# Altium project Group_1.PrjPcb
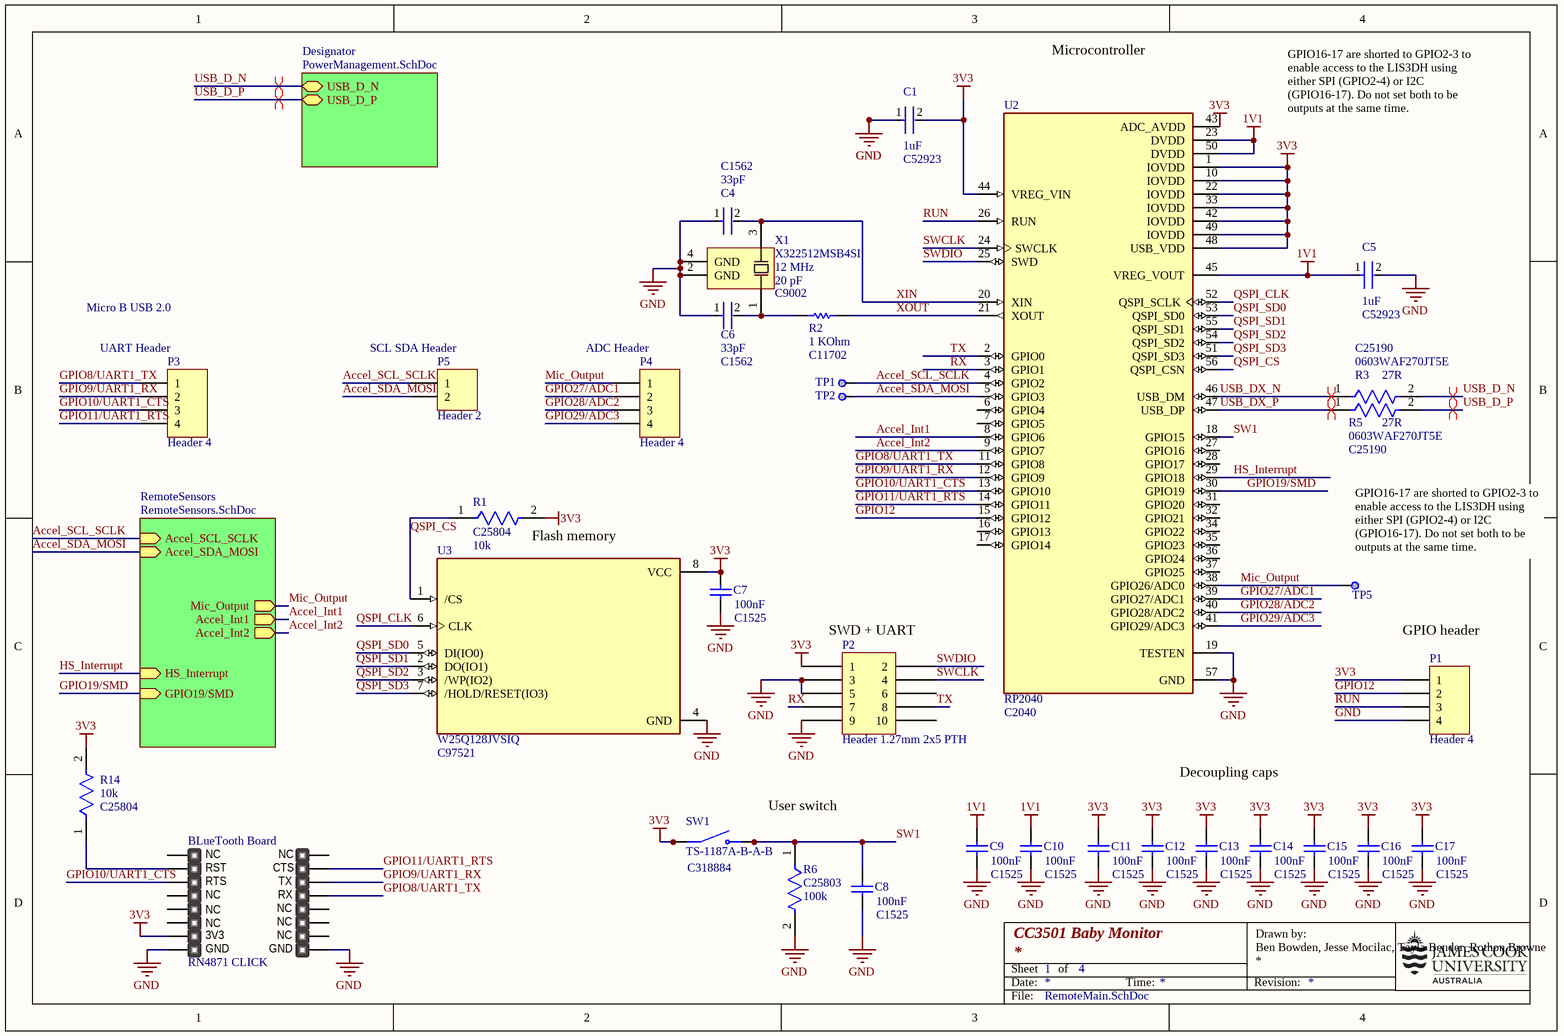
[diagram p0: RemoteMain.SchDoc]
3 sheets, 74 parts. Net scope: hierarchical (ports join the sheet entries above them; power ports are global).
Board files: RemoteUnitBoard.PcbDoc, SENSORM-TH_3P_AS312.pcbdoc
Sheets:
  RemoteMain.SchDoc
    RemoteSensors = RemoteSensors.SchDoc
    Designator = PowerManagement.SchDoc

## Sheet RemoteMain.SchDoc
size A4; Author: Ben Bowden, Jesse Mocilac, Tayla Bender, Rothon Browne; CompanyName: James Cook University; DrawnBy1: Ben Bowden, Jesse Mocilac, Tayla Bender, Rothon Browne; Organization: James Cook University; Title1: CC3501 Baby Monitor; SheetNumber: 1; SheetTotal: 4; ProjectName: *ProjectName

### Parts
BLueTooth_Board  RN4871 CLICK  [mikroBUS - Large]  (no BOM)
C1  JLCPCB Part: C52923  Capacitance: 1uF  [FP-CL542-IPC_C]  (hidden comment: CL05A105KA5NQNC)
C4  JLCPCB Part: C1562  Capacitance: 33pF  [FP-0402-L_1_0_1-W_0_5_0_1-IPC_A]  (hidden comment: 0402CG330J500NT)
C5  JLCPCB Part: C52923  Capacitance: 1uF  [FP-CL542-IPC_C]  (hidden comment: CL05A105KA5NQNC)
C6  JLCPCB Part: C1562  Capacitance: 33pF  [FP-0402-L_1_0_1-W_0_5_0_1-IPC_A]  (hidden comment: 0402CG330J500NT)
C7  JLCPCB Part: C1525  Capacitance: 100nF  [CAPC1050X55X23ML05T13]  (hidden comment: CL05B104KO5NNNC)
C8  JLCPCB Part: C1525  Capacitance: 100nF  [CAPC1050X55X23ML05T13]  (hidden comment: CL05B104KO5NNNC)
C9  JLCPCB Part: C1525  Capacitance: 100nF  [CAPC1050X55X23ML05T13]  (hidden comment: CL05B104KO5NNNC)
C10  JLCPCB Part: C1525  Capacitance: 100nF  [CAPC1050X55X23ML05T13]  (hidden comment: CL05B104KO5NNNC)
C11  JLCPCB Part: C1525  Capacitance: 100nF  [CAPC1050X55X23ML05T13]  (hidden comment: CL05B104KO5NNNC)
C12  JLCPCB Part: C1525  Capacitance: 100nF  [CAPC1050X55X23ML05T13]  (hidden comment: CL05B104KO5NNNC)
C13  JLCPCB Part: C1525  Capacitance: 100nF  [CAPC1050X55X23ML05T13]  (hidden comment: CL05B104KO5NNNC)
C14  JLCPCB Part: C1525  Capacitance: 100nF  [CAPC1050X55X23ML05T13]  (hidden comment: CL05B104KO5NNNC)
C15  JLCPCB Part: C1525  Capacitance: 100nF  [CAPC1050X55X23ML05T13]  (hidden comment: CL05B104KO5NNNC)
C16  JLCPCB Part: C1525  Capacitance: 100nF  [CAPC1050X55X23ML05T13]  (hidden comment: CL05B104KO5NNNC)
C17  JLCPCB Part: C1525  Capacitance: 100nF  [CAPC1050X55X23ML05T13]  (hidden comment: CL05B104KO5NNNC)
P1  Header 4  [HDR1X4]
P2  Header 1.27mm 2x5 PTH  [Header 1.27mm 2x5 PTH]
P3  Header 4  [HDR1X4]
P4  Header 4  [HDR1X4]
P5  Header 2  [HDR1X2]
R1  JLCPCB Part: C25804  Resistance: 10k  [FP-CRCW0603-e3-IPC_B]  (hidden comment: 0603WAF1002T5E)
R2  Resistance: 1 KOhm  JLCPCB Part: C11702  [RESC1005X40X25NL05T05]  (hidden comment: 0402WGF1001TCE)
R3  0603WAF270JT5E  JLCPCB Part: C25190  Resistance: 27R  [FP-CRCW0603-e3-IPC_B]
R5  0603WAF270JT5E  JLCPCB Part: C25190  Resistance: 27R  [FP-CRCW0603-e3-IPC_B]
R6  JLCPCB Part: C25803  Resistance: 100k  [FP-CRCW0603-e3-IPC_B]  (hidden comment: 0603WAF1003T5E)
R14  JLCPCB Part: C25804  Resistance: 10k  [FP-CRCW0603-e3-IPC_B]  (hidden comment: 0603WAF1002T5E)
SW1  TS-1187A-B-A-B  JLCPCB Part: C318884  [SW_TS-1187A-B-A-B]
TP1  Test point  [Test point-Footprint-1]  (value not drawn)  (no BOM)
TP2  Test point  [Test point-Footprint-1]  (value not drawn)  (no BOM)
TP5  Test point  [Test point-Footprint-1]  (value not drawn)  (no BOM)
U2  RP2040  JLCPCB Part: C2040  [QFN40P700X700X90-57N]
U3  W25Q128JVSIQ  JLCPCB Part: C97521  [SOIC127P790X216-8N]
X1  X322512MSB4SI  Frequency: 12 MHz  Load capacitance: 20 pF  JLCPCB Part: C9002  [X322512MSB4SI-Footprint-1]

### Sub-sheets
Designator = PowerManagement.SchDoc: USB_D_N (bidir), USB_D_P (bidir)
RemoteSensors = RemoteSensors.SchDoc: Accel_SCL_SCLK (in), Accel_SDA_MOSI (in), Accel_Int2 (out), Accel_Int1 (out), Mic_Output (out), HS_Interrupt (in), GPIO19/SMD (in)

### Nets
1V1: C5.1 C9.2 C10.2 U2.23(DVDD) U2.45(VREG_VOUT) U2.50(DVDD)
3V3: BLueTooth_Board.7(3.3V) C1.2 C7.2 C11.2 C12.2 C13.2 C14.2 C15.2 C16.2 C17.2 P1.1 P2.1 R1.2 R14.2 SW1.A(COM) SW1.B(COM) U2.1(IOVDD) U2.10(IOVDD) U2.22(IOVDD) U2.33(IOVDD) U2.42(IOVDD) U2.43(ADC_AVDD) U2.44(VREG_VIN) U2.48(USB_VDD) U2.49(IOVDD) U3.8(VCC)
GND: BLueTooth_Board.8(GND) BLueTooth_Board.9(GND) C1.1 C4.1 C5.2 C6.1 C7.1 C8.1 C9.1 C10.1 C11.1 C12.1 C13.1 C14.1 C15.1 C16.1 C17.1 P1.4 P2.3 P2.5 P2.9 R6.2 U2.19(TESTEN) U2.57(GND) U3.4(GND) X1.2(GND) X1.4(GND)
Accel_Int1: U2.8(GPIO6) ; sheet RemoteSensors/Accel_Int1
Accel_Int2: U2.9(GPIO7) ; sheet RemoteSensors/Accel_Int2
Accel_SCL_SCLK: P5.1 TP1.1 U2.4(GPIO2) ; sheet RemoteSensors/Accel_SCL_SCLK
Accel_SDA_MOSI: P5.2 TP2.1 U2.5(GPIO3) ; sheet RemoteSensors/Accel_SDA_MOSI
GPIO8/UART1_TX: BLueTooth_Board.13(TX) P3.1 U2.11(GPIO8)
GPIO9/UART1_RX: BLueTooth_Board.14(RX) P3.2 U2.12(GPIO9)
GPIO10/UART1_CTS: BLueTooth_Board.3(CS) P3.3 U2.13(GPIO10)
GPIO11/UART1_RTS: BLueTooth_Board.15(INT) P3.4 U2.14(GPIO11)
GPIO12: P1.2 U2.15(GPIO12)
GPIO19/SMD: U2.30(GPIO19) ; sheet RemoteSensors/GPIO19/SMD
GPIO27/ADC1: P4.2 U2.39(GPIO27/ADC1)
GPIO28/ADC2: P4.3 U2.40(GPIO28/ADC2)
GPIO29/ADC3: P4.4 U2.41(GPIO29/ADC3)
HS_Interrupt: U2.29(GPIO18) ; sheet RemoteSensors/HS_Interrupt
Mic_Output: P4.1 TP5.1 U2.38(GPIO26/ADC0) ; sheet RemoteSensors/Mic_Output
QSPI_CLK: U2.52(QSPI_SCLK) U3.6(CLK)
QSPI_CS: R1.1 U2.56(QSPI_CSN) U3.1(/CS)
QSPI_SD0: U2.53(QSPI_SD0) U3.5(DI(IO0))
QSPI_SD1: U2.55(QSPI_SD1) U3.2(DO(IO1))
QSPI_SD2: U2.54(QSPI_SD2) U3.3(/WP(IO2))
QSPI_SD3: U2.51(QSPI_SD3) U3.7(/HOLD/RESET(IO3))
RUN: P1.3 U2.26(RUN)
RX: P2.7 U2.3(GPIO1)
SW1: C8.2 R6.1 SW1.C(NO) SW1.D(NO) U2.18(GPIO15)
SWCLK: P2.4 U2.24(SWCLK)
SWDIO: P2.2 U2.25(SWD)
TX: P2.8 U2.2(GPIO0)
USB_D_N: R3.2 ; sheet Designator/USB_D_N
USB_D_P: R5.2 ; sheet Designator/USB_D_P
USB_DX_N: R3.1 U2.46(USB_DM)
USB_DX_P: R5.1 U2.47(USB_DP)
XIN: C4.2 U2.20(XIN) X1.3(OSC2)
XOUT: R2.2 U2.21(XOUT)
NetBLueTooth_Board_2: BLueTooth_Board.2(RST) R14.1
NetC6_2: C6.2 R2.1 X1.1(OSC1)

Not connected (* = marked no-connect by the designer): BLueTooth_Board 1(AN) 4(SCK) 5(MISO) 6(MOSI) 10(5V) 11(SDA) 12(SCL) 16(PWM); P2 6 10; U2 6(GPIO4) 7(GPIO5) 16(GPIO13) 17(GPIO14) 27(GPIO16) 28(GPIO17) 31(GPIO20) 32(GPIO21) 34(GPIO22) 35(GPIO23) 36(GPIO24) 37(GPIO25)

### Layout directives
differential pair: USB_D_N, USB_D_P, USB_DX_N, USB_DX_P

### Notes on the sheet
- Microcontroller
- GPIO16-17 are shorted to GPIO2-3 to enable access to the LIS3DH using either SPI (GPIO2-4) or I2C (GPIO16-17). Do not set both to be outputs at the same time.
- Micro B USB 2.0
- (near P3) UART Header
- (near P5) SCL SDA Header
- (near P4) ADC Header
- Flash memory
- (near TP5) GPIO16-17 are shorted to GPIO2-3 to enable access to the LIS3DH using either SPI (GPIO2-4) or I2C (GPIO16-17). Do not set both to be outputs at the same time.
- (near P2) SWD + UART
- GPIO header
- Decoupling caps
- User switch
- Date:
- Sheet
- of
- Time:
- Revision:
- Drawn by:
- File:
- (in symbol CMP-011-00000-2) NC; CTS; RTS; 3V3

### Library data of the parts
BLueTooth_Board = CMP-011-00000-2: mikroBUS compatible add-on board; Design Item ID: mikroBUS compatible add-on board; Source: mikroBUS_Add-on_standard.SchLib
C1 C5 = CMP-00005-3: Cap Ceramic 1uF 25V X5R ±10% SMD 0402 +85°C Paper T/R; Case Code (Imperial): 0402; Thickness: 0.022inch; Material: Ceramic; Length: 1mm; Voltage Rating: 25V; Lead Free: Lead Free; Package Quantity: 10000; Min Operating Temperature: -55°C; Radiation Hardening: No; Case/Package: 0402; Case Code (Metric): 1005; Height: 0.5mm; Width: 0.02inch; Mount: Surface Mount; Dielectric: X5R; Tolerance: 10%; Depth: 0.5mm; Max Operating Temperature: 85°C; Packaging: Tape and Reel
C4 C6 = CMP-00008-5: General Purpose Ceramic Capacitor, 0402, 33pF, 5%, C0G, 30ppm/°C, 50V; Insulation Resistance: 100GR; RoHS Compliant: Yes; REACH SVHC: No SVHC; Package Quantity: 1; Voltage Rating (DC): 50V; Voltage: 50V; Length: 1mm; Number of Pins: 2; Case Code (Imperial): 0402; Mount: Surface Mount; Min Operating Temperature: -55°C; Radiation Hardening: No; Max Operating Temperature: 125°C; Contact Plating: Tin; Case/Package: 0402; Thickness: 0.022inch; Height: 0.5mm; Construction: Flat; Tolerance: 5%; Depth: 0.5mm; Case Code (Metric): 1005; Series: -; Temperature Coefficient: 30ppm/°C; Lead Free: Lead Free; Voltage Rating: 50V; Packaging: Tape and Reel; Width: 0.5mm; Dielectric: C0G; Termination: SMD/SMT
C7-C17 = CMP-00007-3: Chip Capacitor, 100 nF, +/- 10%, 16 V, -55 to 125 degC, 0402 (1005 Metric), RoHS, Tape and Reel; Manufacturer: Samsung Electro-Mechanics; Dielectric: X7R; Rated Voltage: 16V; Manufacturer URL: http://www.samsungsem.com/global/index.jsp; Case Size/Dimension: 0402; Tolerance (%): ±10%; Datasheet Version: Nov-10; Datasheet URL: https://datasheet.ciiva.com/29198/458718-da-01-en-vs-kondensator-0402-29198423.pdf
P1 P3 P4 = CMP-002-00124-1: Header, 4-Pin; Signal Integrity: Connector; LatestRevisionNote: Re-released for DXP Platform.; Component Type: Standard; Design Item ID: Header 4; Source: Miscellaneous Connectors.SchLib; Pin Count: 4; Publisher: Altium Limited; LatestRevisionDate: 17-Jul-2002
P2 = CMP-005-0002-2: Header 1.27mm pitch, 2x5, PTH through hole; Pins: 10; element14 Item: 1577743; Design Item ID: Header 1.27mm 2x5 PTH; Source: JCULibrary.SchLib; Component Type: Standard
P5 = CMP-002-00097-1: Header, 2-Pin; Signal Integrity: Connector; LatestRevisionDate: 17-Jul-2002; Publisher: Altium Limited; Pin Count: 2; Design Item ID: Header 2; LatestRevisionNote: Re-released for DXP Platform.; Source: Miscellaneous Connectors.SchLib; Component Type: Standard
R1 R14 = CMP-009-0009-1: RES Thick Film, 10kΩ, 1%, 0.1W, 100ppm/°C, 0603; Voltage Rating: 75V; Power Rating: 100mW; Composition: Thick Film; Military Standard: Not; Temperature Coefficient: 100ppm/°C; Length: 1.55mm; Tolerance: 1%; Lead Free: Lead Free; Max Operating Temperature: 155°C; Number of Pins: 2; Width: 0.85mm; Termination: SMD/SMT; Packaging: Tape and Reel; Weight: 7.1E-05oz; Radiation Hardening: No; Voltage Rating (DC): 75V; Height: 0.45mm; Min Operating Temperature: -55°C; Mount: Surface Mount; Contact Plating: Tin; Case Code (Metric): 1608; Case Code (Imperial): 0603; Depth: 0.85mm; Case/Package: 0603; Package Quantity: 5000
R2 = CMP-009-0000-2: Chip Resistor, 1 KOhm, +/- 1%, 100 mW, -55 to 155 degC, 0402 (1005 Metric), RoHS, Tape and Reel; Manufacturer: Basic Passives; Power Rating: 100 mW; Case\/Package: 0402; Voltage Rating: 50 V; RoHSCompliant: true; Mount: Surface Mount; Length: 1 mm; Height: 0.35 mm; Pins: 2; Case Code (Imperial): 0402; PackageDescription: 2-Pin Surface Mount Device, Body 1 x 0.5 mm; Radiation Hardening: No; Width: 0.5 mm; Mounting Technology: Surface Mount; PackageReference: 0402; Case Code (Metric): 1005; Packaging: Tape and Reel; Max Operating Temperature: 155 degC; PartNumber: 0402WGF1001TCE; Package Quantity: 10000; Min Operating Temperature: -55 degC; Tolerance: 1%; REACH SVHC: Yes
R3 R5 = CMP-00004-5: RES Thick Film, 27Ω, 1%, 0.1W, 200ppm/°C, 0603; Power Rating: 100mW; Temperature Coefficient: 100ppm/°C; Voltage Rating: 75V; Length: 1.55mm; Radiation Hardening: No; Width: 0.85mm; Case Code (Metric): 1608; Composition: Thick Film; Max Operating Temperature: 155°C; Number of Pins: 2; Contact Plating: Tin; Weight: 7.1E-05oz; Case Code (Imperial): 0603; Min Operating Temperature: -55°C; Mount: Surface Mount; Height: 0.45mm; Package Quantity: 5000; Military Standard: Not; Voltage Rating (DC): 75V; Packaging: Tape and Reel; Lead Free: Lead Free; Depth: 0.85mm; Termination: SMD/SMT; Case/Package: 0603; Tolerance: 1%
R6 = CMP-009-0004-3: RES Thick Film, 100kΩ, 1%, 0.1W, 100ppm/°C, 0603; Power Rating: 100mW; Voltage Rating: 75V; Mount: Surface Mount; Number of Pins: 2; Depth: 0.85mm; Case/Package: 0603; Composition: Thick Film; Max Operating Temperature: 155°C; Case Code (Metric): 1608; Contact Plating: Tin; Temperature Coefficient: 100ppm/°C; Weight: 7.1E-05oz; Height: 0.45mm; Termination: SMD/SMT; Tolerance: 1%; Min Operating Temperature: -55°C; Lead Free: Lead Free; Voltage Rating (DC): 75V; Case Code (Imperial): 0603; Length: 1.55mm; Packaging: Tape and Reel; Package Quantity: 5000; Radiation Hardening: No; Width: 0.85mm; Military Standard: Not
SW1 = CMP-051-000000-5: SPST 50mA @ 12VDC Top Actuated Round Button 160gf SMD Tactile Switches RoHS; Source: TS-1187A-B-A-B.SchLib; Package: None; Availability: Unavailable; MP: TS-1187A-B-A-B; Value: *; Price: None; Pin Count: 4; Component Type: Standard; Design Item ID: TS-1187A-B-A-B
TP1 TP2 TP5 = CMP-004-0001-1: Test point for in-circuit debugging (0.3mm hole, 0.7mm diameter)
U2 = CMP-043-000000-5: ARM Cortex-M0+ MCU 32-Bit Microcontroller for Raspberry Pi Pico; Design Item ID: RP2040; Price: None; Component Type: Standard; Package: None; Availability: Available; Value: *; Pin Count: 57; Source: RP2040.SchLib; MP: RP2040
U3 = CMP-031-00006-4: FLASH - NOR Memory IC 128Mb (16M x 8) SPI - Quad I/O, QPI, DTR 133 MHz 8-SOIC; MF: Winbond Electronics; MP: W25Q128JVSIQ; Design Item ID: W25Q128JVSIQ; Check_prices: https://www.snapeda.com/parts/W25Q128JVSIQ/Winbond+Electronics/view-part/?ref=eda; Price: None; Purchase-URL: https://pricing.snapeda.com/search/part/W25Q128JVSIQ/?ref=eda; Pin Count: 8; Package: SOIC-8 Winbond; Availability: In Stock; Source: W25Q128JVSIQ.SchLib; Value: *; SnapEDA_Link: https://www.snapeda.com/parts/W25Q128JVSIQ/Winbond+Electronics/view-part/?ref=snap; Component Type: Standard
X1 = CMP-00002-4: 12MHz SMD Crystal Resonator 20pF ±10ppm ±30ppm -40℃~+85℃ SMD3225-4P  Crystals ROHS Yangxing Tech; Max ESR: 80 Ω

## Sheet RemoteSensors.SchDoc
size A4; Author: Ben Bowden, Jesse Mocilac, Tayla Bender, Rothon Browne; CompanyName: James Cook University; DrawnBy1: Ben Bowden, Jesse Mocilac, Tayla Bender, Rothon Browne; Organization: James Cook University; Title1: CC3501 Baby Monitor; SheetNumber: 3; SheetTotal: 4; ProjectName: *ProjectName
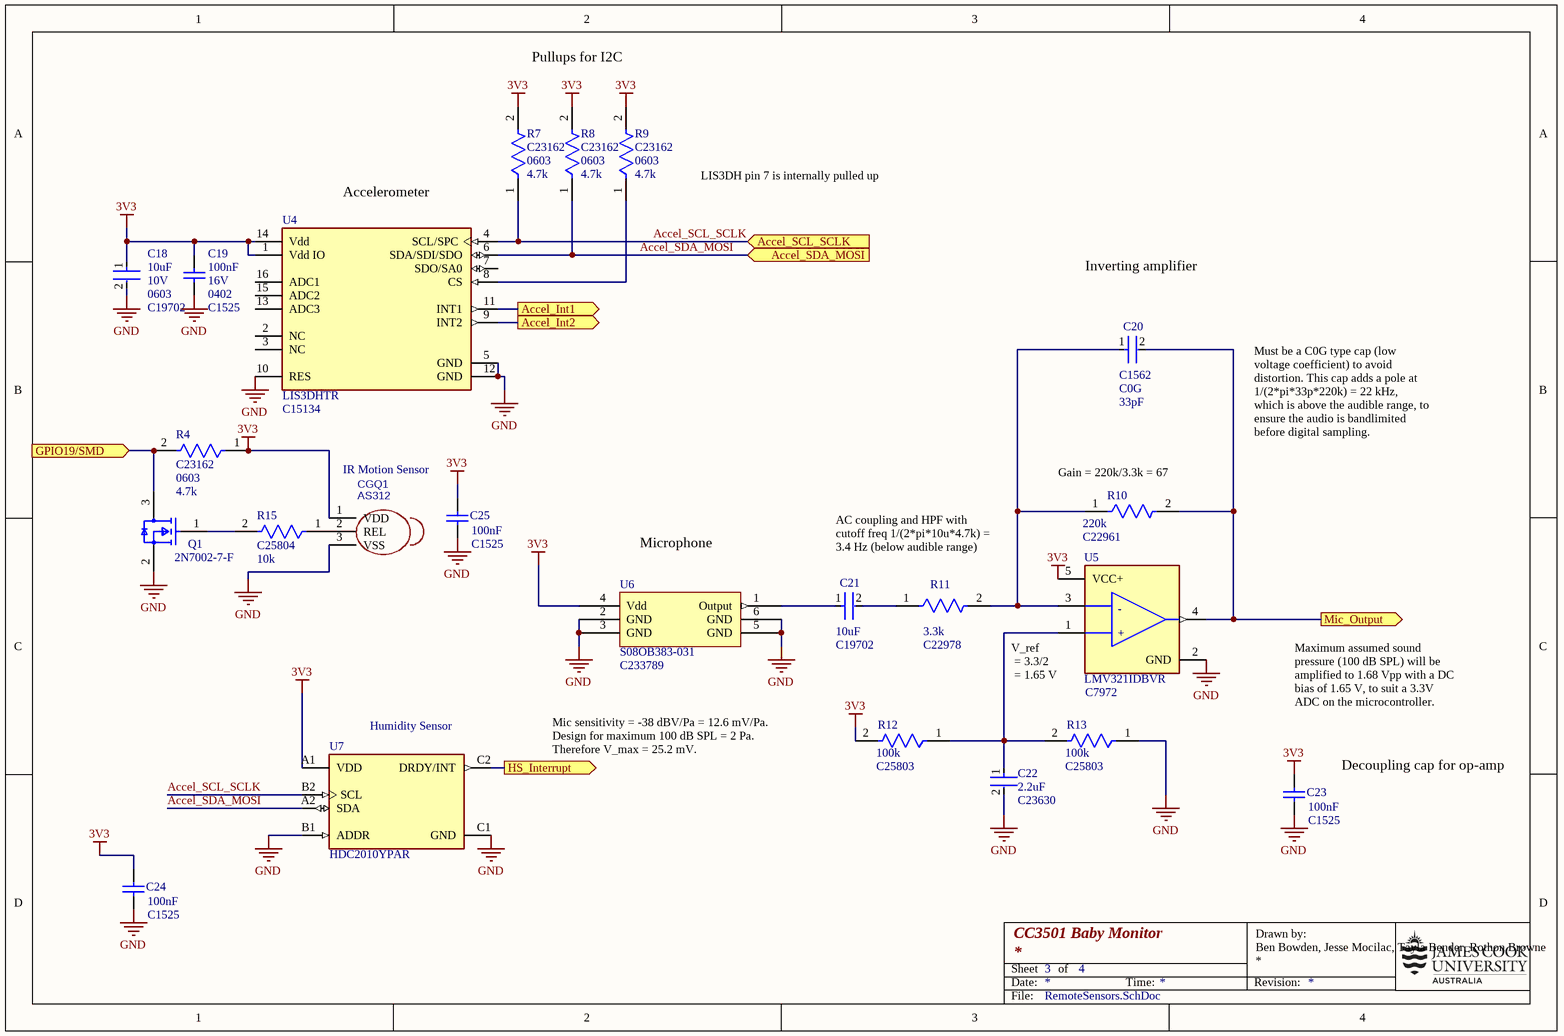
[diagram p1: RemoteSensors.SchDoc]

### Parts
C18  Voltage Rating: 10V  Case Code (Imperial): 0603  JLCPCB Part: C19702  Capacitance: 10uF  [FP-CL10-IPC_B]  (hidden comment: CL10A106KP8NNNC)
C19  JLCPCB Part: C1525  Case Size/Dimension: 0402  Capacitance: 100nF  Rated Voltage: 16V  [CAPC1050X55X23ML05T13]  (hidden comment: CL05B104KO5NNNC)
C20  Capacitance: 33pF  Dielectric: C0G  JLCPCB Part: C1562  [FP-0402-L_1_0_1-W_0_5_0_1-IPC_A]  (hidden comment: 0402CG330J500NT)
C21  JLCPCB Part: C19702  Capacitance: 10uF  [FP-CL10-IPC_B]  (hidden comment: CL10A106KP8NNNC)
C22  Capacitance: 2.2uF  JLCPCB Part: C23630  [FP-CL10-IPC_B]  (hidden comment: CL10A225KO8NNNC)
C23  JLCPCB Part: C1525  Capacitance: 100nF  [CAPC1050X55X23ML05T13]  (hidden comment: CL05B104KO5NNNC)
C24  JLCPCB Part: C1525  Capacitance: 100nF  [CAPC1050X55X23ML05T13]  (hidden comment: CL05B104KO5NNNC)
C25  JLCPCB Part: C1525  Capacitance: 100nF  [CAPC1050X55X23ML05T13]  (hidden comment: CL05B104KO5NNNC)
CGQ1  AS312  [SENSORM-TH_3P_AS312]
Q1  2N7002-7-F  [FP-SOT23-MFG]
R4  JLCPCB Part: C23162  Case/Package: 0603  Resistance: 4.7k  [FP-CRCW0603-e3-IPC_B]  (hidden comment: 0603WAF4701T5E)
R7  JLCPCB Part: C23162  Case/Package: 0603  Resistance: 4.7k  [FP-CRCW0603-e3-IPC_B]  (hidden comment: 0603WAF4701T5E)
R8  JLCPCB Part: C23162  Case/Package: 0603  Resistance: 4.7k  [FP-CRCW0603-e3-IPC_B]  (hidden comment: 0603WAF4701T5E)
R9  JLCPCB Part: C23162  Case/Package: 0603  Resistance: 4.7k  [FP-CRCW0603-e3-IPC_B]  (hidden comment: 0603WAF4701T5E)
R10  Resistance: 220k  JLCPCB Part: C22961  [FP-CRCW0603-e3-IPC_B]  (hidden comment: 0603WAF2203T5E)
R11  JLCPCB Part: C22978  Resistance: 3.3k  [FP-CRCW0603-e3-IPC_B]  (hidden comment: 0603WAF3301T5E)
R12  JLCPCB Part: C25803  Resistance: 100k  [FP-CRCW0603-e3-IPC_B]  (hidden comment: 0603WAF1003T5E)
R13  JLCPCB Part: C25803  Resistance: 100k  [FP-CRCW0603-e3-IPC_B]  (hidden comment: 0603WAF1003T5E)
R15  JLCPCB Part: C25804  Resistance: 10k  [FP-CRCW0603-e3-IPC_B]  (hidden comment: 0603WAF1002T5E)
U4  LIS3DHTR  JLCPCB Part: C15134  [FP-LGA-16-7983231-MFG]
U5  LMV321IDBVR  JLCPCB Part: C7972  [FP-DBV0005A-IPC_B]
U6  S08OB383-031  JLCPCB Part: C233789  [Goertek_S08OB381-026]
U7  HDC2010YPAR  [FP-YPA0006-MFG]

### Ports
Accel_Int1 (out), Accel_Int2 (out), Accel_SCL_SCLK (in), Accel_SDA_MOSI (in), GPIO19/SMD (in), HS_Interrupt (out), Mic_Output (out)

### Nets
3V3: C18.1 C19.2 C23.2 C24.2 C25.2 CGQ1.1(VDD) R4.1 R7.2 R8.2 R9.2 R12.2 U4.1(Vdd_IO) U4.14(Vdd) U5.5(VCC+) U6.4(Vdd) U7.A1(VDD)
GND: C18.2 C19.1 C22.2 C23.1 C24.1 C25.1 CGQ1.3(VSS) Q1.2(S) R13.1 U4.5(GND) U4.10(RES) U4.12(GND) U5.2(GND) U6.2(GND) U6.3(GND) U6.5(GND) U6.6(GND) U7.B1(ADDR) U7.C1(GND)
Accel_Int1: U4.11(INT1) ; port Accel_Int1
Accel_Int2: U4.9(INT2) ; port Accel_Int2
Accel_SCL_SCLK: R7.1 U4.4(SCL/SPC) U7.B2(SCL) ; port Accel_SCL_SCLK
Accel_SDA_MOSI: R8.1 U4.6(SDA/SDI/SDO) U7.A2(SDA) ; port Accel_SDA_MOSI
GPIO19/SMD: Q1.3(D) R4.2 ; port GPIO19/SMD
HS_Interrupt: U7.C2(DRDY/INT) ; port HS_Interrupt
Mic_Output: C20.2 R10.2 U5.4(OUT) ; port Mic_Output
NetC20_1: C20.1 R10.1 R11.2 U5.3(1IN-)
NetC21_1: C21.1 U6.1(Output)
NetC21_2: C21.2 R11.1
NetC22_1: C22.1 R12.1 R13.2 U5.1(1IN+)
NetCGQ1_2: CGQ1.2(REL) R15.1
NetQ1_1: Q1.1(G) R15.2
NetR9_1: R9.1 U4.8(CS)

Not connected (* = marked no-connect by the designer): U4 2(NC) 3(NC) 7(SDO/SA0) 13(ADC3) 15(ADC2) 16(ADC1)

### Notes on the sheet
- Pullups for I2C
- (near U4) Accelerometer
- LIS3DH pin 7 is internally pulled up
- Inverting amplifier
- IR Motion Sensor
- (near R10) Gain = 220k/3.3k = 67
- Must be a C0G type cap (low voltage coefficient) to avoid distortion. This cap adds a pole at 1/(2*pi*33p*220k) = 22 kHz, which is above the audible range, to ensure the audio is bandlimited before digital sampling.
- Microphone
- AC coupling and HPF with cutoff freq 1/(2*pi*10u*4.7k) = 3.4 Hz (below audible range)
- (near U5) V_ref
  = 3.3/2
  = 1.65 V
- Maximum assumed sound pressure (100 dB SPL) will be amplified to 1.68 Vpp with a DC bias of 1.65 V, to suit a 3.3V ADC on the microcontroller.
- (near U7) Humidity Sensor
- Mic sensitivity = -38 dBV/Pa = 12.6 mV/Pa.
  Design for maximum 100 dB SPL = 2 Pa.
  Therefore V_max = 25.2 mV.
- (near C23) Decoupling cap for op-amp
- Date:
- Sheet
- of
- Time:
- Revision:
- Drawn by:
- File:
- (in symbol CMP-00012-2) +

### Library data of the parts
C18 C21 = CMP-00006-4: Cap Ceramic 10uF 10V X5R ±10% Pad SMD 0603 +85°C T/R; Max Operating Temperature: 85°C; Tolerance: 10%; Case/Package: 0603; Mount: Surface Mount; Packaging: Tape and Reel; Width: 0.031inch; Thickness: 0.041inch; Length: 0.063inch; Case Code (Metric): 1608; Min Operating Temperature: -55°C
  C21: Voltage Rating: 10V; Case Code (Imperial): 0603
C19 = CMP-00007-3: Chip Capacitor, 100 nF, +/- 10%, 16 V, -55 to 125 degC, 0402 (1005 Metric), RoHS, Tape and Reel; Manufacturer: Samsung Electro-Mechanics; Dielectric: X7R; Manufacturer URL: http://www.samsungsem.com/global/index.jsp; Tolerance (%): ±10%; Datasheet Version: Nov-10; Datasheet URL: https://datasheet.ciiva.com/29198/458718-da-01-en-vs-kondensator-0402-29198423.pdf
C20 = CMP-00008-5: as C4 on sheet RemoteMain; RoHS Compliant: Yes; Case Code (Metric): 1005; Voltage Rating (DC): 50V; REACH SVHC: No SVHC; Packaging: Tape and Reel; Length: 1mm; Radiation Hardening: No; Mount: Surface Mount; Depth: 0.5mm; Width: 0.5mm; Series: -; Thickness: 0.022inch; Contact Plating: Tin; Voltage Rating: 50V; Case/Package: 0402; Construction: Flat; Max Operating Temperature: 125°C; Lead Free: Lead Free; Voltage: 50V; Termination: SMD/SMT; Height: 0.5mm; Case Code (Imperial): 0402; Temperature Coefficient: 30ppm/°C; Number of Pins: 2; Min Operating Temperature: -55°C; Package Quantity: 1; Tolerance: 5%
C22 = CMP-006-0001-1: Cap Ceramic 2.2uF 16V X5R ±20% Pad SMD 0603 +85°C T/R; Tolerance: 10%; Case Code (Metric): 1608; Thickness: 0.035inch; Case Code (Imperial): 0603; Width: 0.031inch; Voltage Rating: 16V; Min Operating Temperature: -55°C; Case/Package: 0603; Max Operating Temperature: 85°C; Length: 1.6mm; Packaging: Tape and Reel; Mount: Surface Mount
C23-C25 = CMP-00007-3: as C7 on sheet RemoteMain; Manufacturer URL: http://www.samsungsem.com/global/index.jsp; Case Size/Dimension: 0402; Tolerance (%): ±10%; Datasheet Version: Nov-10; Datasheet URL: https://datasheet.ciiva.com/29198/458718-da-01-en-vs-kondensator-0402-29198423.pdf
CGQ1 = AS312: Manufacturer: 森霸; Supplier: LCSC; Manufacturer Part: AS312; Supplier Part: C90465; JLCPCB Part Class: Extended Part; spicePre: C; spiceSymbolName: AS312
Q1 = CMP-2000-04929-2: MOSFET N-CH 60V 115MA SOT23-3; Turn-On Delay Time: 7ns; Turn-Off Delay Time: 11ns; Drain to Source Resistance: 7.5R; Rise Time: 3ns; Drain to Source Breakdown Voltage: 70V; Input Capacitance: 50pF; Number of Elements: 1; Power Dissipation: 540mW; Max Power Dissipation: 300mW; Fall Time: 5.6ns; Gate to Source Voltage (Vgs): 20V; Threshold Voltage: 2.5V; Element Configuration: Single; Termination: SMD/SMT; Weight: 0.000282oz; Radiation Hardening: No; Max Operating Temperature: 150°C; On-State Resistance: 7.5R; Mount: Surface Mount; Current Rating: 115mA; Contact Plating: Tin; Lead Free: Lead Free; Min Operating Temperature: -55°C; Number of Pins: 3; REACH SVHC: No SVHC; Drain to Source Voltage (Vdss): 60V; Width: 1.3mm; Package Quantity: 3000; Length: 2.9mm; Case/Package: SOT-23; Number of Channels: 1; Dual Supply Voltage: 60V; Packaging: Tape and Reel; Height: 1mm; Voltage Rating (DC): 60V; Nominal Vgs: 2.5V; Continuous Drain Current (ID): 115mA; Voltage: 60V; Rds On Max: 7.5R
R4 R7-R9 = CMP-009-0001-3: RES Thick Film, 4.7kΩ, 1%, 0.1W, 100ppm/°C, 0603; Voltage Rating (DC): 75V; Power Rating: 100mW; Mount: Surface Mount; Width: 0.85mm; Weight: 7.1E-05oz; Case Code (Imperial): 0603; Radiation Hardening: No; Min Operating Temperature: -55°C; Composition: Thick Film; Temperature Coefficient: 100ppm/°C; Voltage Rating: 75V; Length: 1.55mm; Height: 0.45mm; Termination: SMD/SMT; Max Operating Temperature: 155°C; Military Standard: Not; Packaging: Tape and Reel; Contact Plating: Tin; Lead Free: Lead Free; Package Quantity: 5000; Number of Pins: 2; Depth: 0.85mm; Tolerance: 1%; Case Code (Metric): 1608
R10 = CMP-009-0005-2: RES Thick Film, 220kΩ, 1%, 0.1W, 100ppm/°C, 0603; Voltage Rating: 75V; Power Rating: 100mW; Packaging: Tape and Reel; Width: 0.85mm; Military Standard: Not; Package Quantity: 5000; Depth: 0.85mm; Lead Free: Lead Free; Min Operating Temperature: -55°C; Case Code (Imperial): 0603; Max Operating Temperature: 155°C; Height: 0.45mm; Mount: Surface Mount; Temperature Coefficient: 100ppm/°C; Radiation Hardening: No; Termination: SMD/SMT; Contact Plating: Tin; Length: 1.55mm; Voltage Rating (DC): 75V; Composition: Thick Film; Case Code (Metric): 1608; Tolerance: 1%; Number of Pins: 2; Case/Package: 0603; Weight: 7.1E-05oz
R11 = CMP-009-0006-1: RES Thick Film, 3.3kΩ, 1%, 0.1W, 100ppm/°C, 0603; Voltage Rating (DC): 75V; Power Rating: 100mW; Case Code (Metric): 1608; Case/Package: 0603; Termination: SMD/SMT; Weight: 7.1E-05oz; Tolerance: 1%; Width: 0.85mm; Temperature Coefficient: 100ppm/°C; Length: 1.55mm; Max Operating Temperature: 155°C; Lead Free: Lead Free; Package Quantity: 5000; Voltage Rating: 75V; Military Standard: Not; Height: 0.45mm; Case Code (Imperial): 0603; Min Operating Temperature: -55°C; Packaging: Tape and Reel; Contact Plating: Tin; Radiation Hardening: No; Number of Pins: 2; Mount: Surface Mount; Depth: 0.85mm; Composition: Thick Film
R12 R13 = CMP-009-0004-3: as R6 on sheet RemoteMain; Mount: Surface Mount; Number of Pins: 2; Depth: 0.85mm; Case/Package: 0603; Composition: Thick Film; Max Operating Temperature: 155°C; Case Code (Metric): 1608; Contact Plating: Tin; Temperature Coefficient: 100ppm/°C; Weight: 7.1E-05oz; Height: 0.45mm; Termination: SMD/SMT; Tolerance: 1%; Min Operating Temperature: -55°C; Lead Free: Lead Free; Voltage Rating (DC): 75V; Case Code (Imperial): 0603; Length: 1.55mm; Packaging: Tape and Reel; Package Quantity: 5000; Radiation Hardening: No; Width: 0.85mm; Military Standard: Not
R15 = CMP-009-0009-1: as R1 on sheet RemoteMain; Composition: Thick Film; Military Standard: Not; Temperature Coefficient: 100ppm/°C; Length: 1.55mm; Tolerance: 1%; Lead Free: Lead Free; Max Operating Temperature: 155°C; Number of Pins: 2; Width: 0.85mm; Termination: SMD/SMT; Packaging: Tape and Reel; Weight: 7.1E-05oz; Radiation Hardening: No; Voltage Rating (DC): 75V; Height: 0.45mm; Min Operating Temperature: -55°C; Mount: Surface Mount; Contact Plating: Tin; Case Code (Metric): 1608; Case Code (Imperial): 0603; Depth: 0.85mm; Case/Package: 0603; Package Quantity: 5000
U4 = CMP-00010-2: ACCEL 2-16G I2C/SPI 16LGA; Interface: I2C; Max Supply Voltage: 3.6V; Axis: X, Y, Z; Operating Supply Voltage: 2.5V; Bandwidth: 5kHz; Resolution: 16b; Operating Supply Current: 11uA; Sensor Type: 3 Axis; Min Supply Voltage: 1.71V; Output Type: Digital; Series: -; Number of Pins: 16; Radiation Hardening: No; Package Quantity: 1; Case/Package: LGA; Contact Plating: Gold; Min Operating Temperature: -40°C; REACH SVHC: No SVHC; RoHS Compliant: Yes; Lead Free: Lead Free; Min Supply Voltage (DC): 1.71V; Length: 3mm; Height: 1mm; Max Supply Voltage (DC): 3.6V; Width: 3mm; Max Operating Temperature: 85°C; Depth: 3mm; Packaging: Tape and Reel
U5 = CMP-00012-2: General Purpose Amplifier 1 Circuit Rail-to-Rail SOT-23-5; Slew Rate: 1V/µs; Max Supply Voltage: 5.5V; Input Offset Voltage (Vos): 7mV; Common Mode Rejection Ratio: 50dB; Number of Channels: 1; Supply Current: 250uA; Min Supply Voltage: 2.7V; Input Bias Current: 250nA; Output Current per Channel: 160mA; Operating Supply Current: 130uA; Gain Bandwidth Product: 1MHz; Voltage Gain: 100dB; REACH SVHC: No SVHC; RoHS Compliant: Yes; Max Operating Temperature: 125°C; Number of Pins: 5; Min Operating Temperature: -40°C; Case/Package: SOT-23-5; Packaging: Tape and Reel; Mount: Surface Mount; Technology: BICMOS; Number of Elements: 1; Nominal Supply Current: 250uA; Number of Circuits: 1; Output Current: 160mA; Series: -; Package Quantity: 1; Unity Gain Bandwidth Product: 1MHz; Power Supply Rejection Ratio (PSRR): 50dB; Contact Plating: Tin,Matte; Lead Free: Lead Free; Radiation Hardening: No; Bandwidth: 1MHz; Number of Amplifiers: 1; Amplifier Type: GENERAL PURPOSE
U6 = CMP-00000-2: MEMS Microphone SMD 3.76x3x1.1mm
U7 = CMP-04948-000007-1: GEN 2 HUMIDITY SENSOR; Manufacturer: Texas Instruments; Resolution: 14bits; Sensor Output: I2C; Operating Supply Current: 0.105-650uA; Accuracy: 2%; Min Supply Voltage: 1.62V; Max Supply Voltage: 3.6V; Standoff Height: 0.215mm; Digikey Description: GEN 2 HUMIDITY SENSOR; ComponentLink2URL: http://www.ti.com/lit/ds/symlink/hdc2010.pdf; ComponentLink2Description: Datasheet; RoHS: TRUE; Category: IC; Automotive: No; Ipc Land Pattern Name: BGA6N50P2X3_146X146X67; Device Class L1: Sensors; Height: 0.675mm; Mouser Description: Low Power Humidity and Temperature Digital Sensor 6-DSBGA -40 to 85; Package: YPA0006; Manufacturer Part Number: HDC2010YPAR; Temperature: -40°C to +85°C; Device Class L3: unset; Temperature Range High: +85°C; Lead Free: Yes; Interface: I2C; Device Class L2: Temperature and Humidity Sensors; Temperature Range Low: -40°C; Octopart: https://octopart.com/hdc2010ypar-texas+instruments-84791680

## Sheet PowerManagement.SchDoc
size A4; Author: Ben Bowden, Jesse Mocilac, Tayla Bender, Rothon Browne; CompanyName: James Cook University; DrawnBy1: Ben Bowden, Jesse Mocilac, Tayla Bender, Rothon Browne; Organization: James Cook University; Title1: CC3501 Baby Monitor; SheetNumber: 2; SheetTotal: 4; ProjectName: *ProjectName
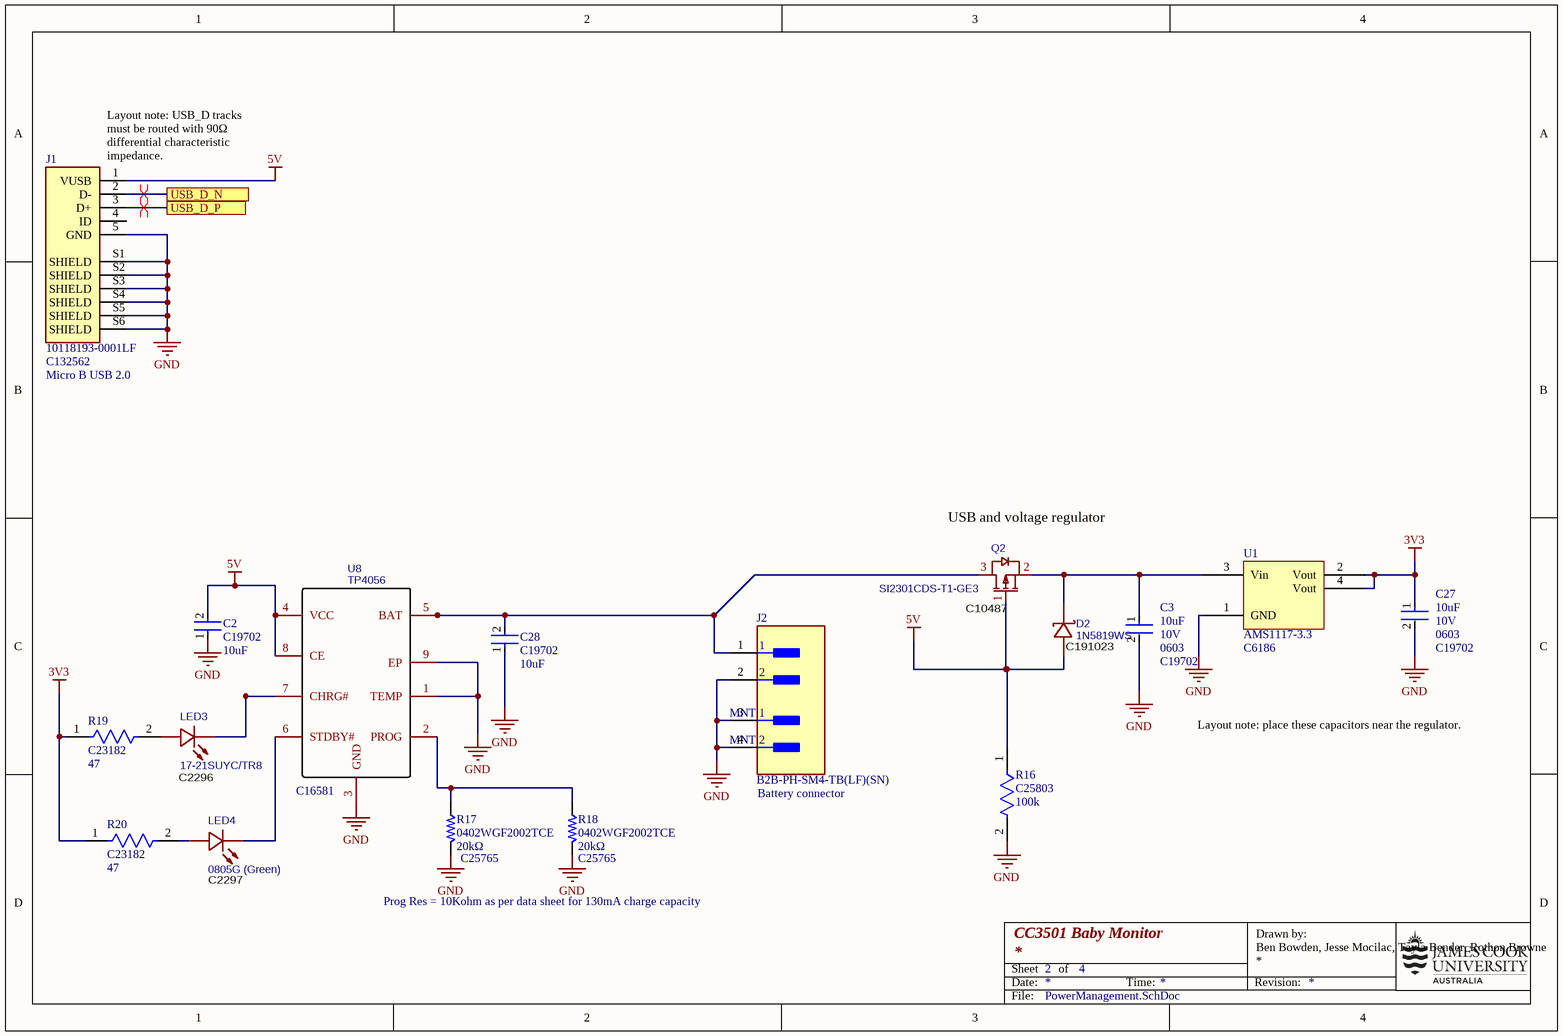
[diagram p2: PowerManagement.SchDoc]

### Parts
C2  JLCPCB Part: C19702  Capacitance: 10uF  [FP-CL10-IPC_B]  (hidden comment: CL10A106KP8NNNC)
C3  Voltage Rating: 10V  Case Code (Imperial): 0603  JLCPCB Part: C19702  Capacitance: 10uF  [FP-CL10-IPC_B]  (hidden comment: CL10A106KP8NNNC)
C27  Voltage Rating: 10V  Case Code (Imperial): 0603  JLCPCB Part: C19702  Capacitance: 10uF  [FP-CL10-IPC_B]  (hidden comment: CL10A106KP8NNNC)
C28  JLCPCB Part: C19702  Capacitance: 10uF  [FP-CL10-IPC_B]  (hidden comment: CL10A106KP8NNNC)
D2  1N5819WS  Supplier Part: C191023  [SOD-323_L1.8-W1.3-LS2.5-RD]
J1  10118193-0001LF  JLCPCB Part: C132562  [FCI_10118193-0001LF]
J2  B2B-PH-SM4-TB(LF)(SN)  [FP-B2B-PH-SM4-TB_LF_SN-MFG]
LED3  17-21SUYC/TR8  Supplier Part: C2296  [LED0805-R-RD]
LED4  0805G (Green)  Supplier Part: C2297  [LED0805-R-RD]
Q2  SI2301CDS-T1-GE3  Supplier Part: C10487  [SOT-23-3_L3.0-W1.7-P0.95-LS2.9-BR]
R16  JLCPCB Part: C25803  Resistance: 100k  [FP-CRCW0603-e3-IPC_B]  (hidden comment: 0603WAF1003T5E)
R17  0402WGF2002TCE  Resistance: 20kΩ  JLCPCB Part Number: C25765  [RES-0402]
R18  0402WGF2002TCE  Resistance: 20kΩ  JLCPCB Part Number: C25765  [RES-0402]
R19  JLCPCB Part: C23182  Resistance: 47  [FP-CRCW0603-e3-IPC_B]  (hidden comment: 0603WAF1003T5E)
R20  JLCPCB Part: C23182  Resistance: 47  [FP-CRCW0603-e3-IPC_B]  (hidden comment: 0603WAF1003T5E)
U1  AMS1117-3.3  JLCPCB Part: C6186  [SOT230P700X180-4N]
U8  TP4056  JLCPCB Part: C16581  [ESOP-8_L4.9-W3.9-P1.27-LS6.0-BL-EP]

### Ports
USB_D_N, USB_D_P

### Nets
3V3: C27.1 R19.1 R20.1 U1.2(Vout) U1.4(Vout)
5V: C2.2 D2.2(A) J1.1(VUSB) Q2.1(G) R16.1 U8.4(VCC) U8.8(CE)
GND: C2.1 C3.2 C27.2 C28.1 J1.5(GND) J1.S1(SHIELD) J1.S2(SHIELD) J1.S3(SHIELD) J1.S4(SHIELD) J1.S5(SHIELD) J1.S6(SHIELD) J2.2 J2.3(MNT_1) J2.4(MNT_2) R16.2 R17.2 R18.2 U1.1(GND) U8.1(TEMP) U8.3(GND) U8.9(EP)
USB_D_N: J1.2(D-) ; port USB_D_N
USB_D_P: J1.3(D+) ; port USB_D_P
NetC3_1: C3.1 D2.1(K) Q2.2(S) U1.3(Vin)
NetC28_2: C28.2 J2.1 Q2.3(D) U8.5(BAT)
NetLED3_1: LED3.1(+) R19.2
NetLED3_2: LED3.2(-) U8.7(CHRG#)
NetLED4_1: LED4.1(A) R20.2
NetLED4_2: LED4.2(K) U8.6(STDBY#)
NetR17_1: R17.1 R18.1 U8.2(PROG)

Not connected (* = marked no-connect by the designer): J1 4(ID)

### Layout directives
differential pair: USB_D_N, USB_D_P

### Notes on the sheet
- (near J1) Layout note: USB_D tracks must be routed with 90Ω differential characteristic impedance.
- (near J1) Micro B USB 2.0
- (near Q2) USB and voltage regulator
- Layout note: place these capacitors near the regulator.
- (near J2) Battery connector
- Prog Res = 10Kohm as per data sheet for 130mA charge capacity
- Date:
- Sheet
- of
- Time:
- Revision:
- Drawn by:
- File:

### Library data of the parts
C2 C3 C27 C28 = CMP-00006-4: as C18 on sheet RemoteSensors; Case Code (Metric): 1608; Packaging: Tape and Reel; Case/Package: 0603; Mount: Surface Mount; Max Operating Temperature: 85°C; Width: 0.031inch; Length: 0.063inch; Thickness: 0.041inch; Tolerance: 10%; Min Operating Temperature: -55°C
  C2 C28: Voltage Rating: 10V; Case Code (Imperial): 0603
D2 = 1N5819WS: Manufacturer: Hottech(合科泰); Contributor: LCSC; Supplier: LCSC; Manufacturer Part: 1N5819WS; JLCPCB Part Class: Basic Part; spicePre: D; spiceSymbolName: 1N5819WS
J1 = CMP-045-000000-7: USB - micro B USB 2.0 Receptacle Connector 5 Position Surface Mount, Right Angle; Through Hole; MF: Amphenol ICC; Pin Count: 11; Package: None; MP: 10118193-0001LF; SnapEDA_Link: https://www.snapeda.com/parts/10118193-0001LF/Amphenol%20FCI/view-part/2758989/?ref=snap; Design Item ID: 10118193-0001LF; Source: SnapEDAsch.SchLib; Component Type: Standard
J2 = CMP-2000-05163-2: CONN HEADER SMD 2POS 2MM; Number of Poles: 2; Max Current Rating: 2A; Gender: Male; Working Voltage: 100V; Mated Stacking Heights: 8.6mm; Contact Resistance: 20mR; Insulation Resistance: 1GR; Number of Contacts: 2; Housing Material: Polyamide; Lead Pitch: 2mm; Packaging: Tape and Reel; Fastening Type: Detent; Contact Finish - Mating: TIN; Width: 5.5mm; Min Operating Temperature: -25°C; Mount: Surface Mount; Current Rating: 2A; Pitch: 2mm; REACH SVHC: No SVHC; Flammability Rating: UL94 V-0; Contact Plating: Tin; Voltage Rating (AC): 100V; Length: 7.95mm; Number of Rows: 1; Max Operating Temperature: 85°C; Connector Type: Header; Height: 9.4mm; Insulation Material: Nylon; Depth: 5mm; Color: White; Termination: Solder; Housing Color: Beige; Contact Mating Length: 0.13inch; Contact Material: Copper Alloy; Orientation: Straight; Contact Type: Male Pin; Lead Free: Lead Free; Voltage Rating: 100V; Series: PH; Number of Positions: 2; Contact Shape: Square; Max Voltage Rating (AC): 100V; Insulation Color: Natural
LED3 = 17-21SUYC/TR8: Manufacturer: KENTO; Manufacturer Part: KT-0805黄灯; Supplier: LCSC; JLCPCB Part Class: Basic Part; spicePre: L; spiceSymbolName: 17-21SUYC/TR8
LED4 = 0805G (Green): Manufacturer: KENTO; Manufacturer Part: KT-0805G; Supplier: LCSC; JLCPCB Part Class: Basic Part; spicePre: L; spiceSymbolName: 0805G (Green)
Q2 = SI2301CDS-T1-GE3: Manufacturer: VISHAY(威世); Supplier: LCSC; Manufacturer Part: SI2301CDS-T1-GE3; JLCPCB Part Class: Basic Part; spicePre: Q; spiceSymbolName: SI2301CDS-T1-GE3
R16 = CMP-009-0004-3: as R6 on sheet RemoteMain; Mount: Surface Mount; Number of Pins: 2; Depth: 0.85mm; Case/Package: 0603; Composition: Thick Film; Max Operating Temperature: 155°C; Case Code (Metric): 1608; Contact Plating: Tin; Temperature Coefficient: 100ppm/°C; Weight: 7.1E-05oz; Height: 0.45mm; Termination: SMD/SMT; Tolerance: 1%; Min Operating Temperature: -55°C; Lead Free: Lead Free; Voltage Rating (DC): 75V; Case Code (Imperial): 0603; Length: 1.55mm; Packaging: Tape and Reel; Package Quantity: 5000; Radiation Hardening: No; Width: 0.85mm; Military Standard: Not
R17 R18 = CMP-009-00024-1: Resistor, 20kΩ, ±1%, 62.5mW, 50V, ±100ppm/℃, -55℃~+155℃, SMD 0402; Manufacturer: Uniroyal; ComponentLink2Description: JLCPCB Part URL; Tolerance: ±1%; JLCPCB Basic Part: Yes; ComponentLink1Description: Datasheet; Temperature Rating: -55℃~+155℃; Voltage Rating: 50V; Design Item ID: 0402WGF2002TCE; Category: Resistors; Package Size: 0402; ComponentLink1URL: https://datasheet.lcsc.com/lcsc/2206010100_UNI-ROYAL-Uniroyal-Elec-0402WGF2002TCE_C25765.pdf; Source: jlcpcb_resistors_basic.schlib; ComponentLink2URL: https://jlcpcb.com/partdetail/C25765; Temperature Coefficient: ±100ppm/℃; Power Rating: 62.5mW; Manufacturer Part Number: 0402WGF2002TCE
R19 R20 = CMP-009-0004-3: RES Thick Film, 47Ω, 1%, 0.1W, 100ppm/°C, 0603; Power Rating: 100mW; Voltage Rating: 75V; Mount: Surface Mount; Number of Pins: 2; Depth: 0.85mm; Case/Package: 0603; Composition: Thick Film; Max Operating Temperature: 155°C; Case Code (Metric): 1608; Contact Plating: Tin; Temperature Coefficient: 100ppm/°C; Weight: 7.1E-05oz; Height: 0.45mm; Termination: SMD/SMT; Tolerance: 1%; Min Operating Temperature: -55°C; Lead Free: Lead Free; Voltage Rating (DC): 75V; Case Code (Imperial): 0603; Length: 1.55mm; Packaging: Tape and Reel; Package Quantity: 5000; Radiation Hardening: No; Width: 0.85mm; Military Standard: Not
U1 = CMP-00001-4: 3.3V 1A LOW DROPOUT VOLTAGE REGULATOR SOT-223; Dropout voltage: 1.3 V; Output voltage: 3.3 V; Output current: 1 A
U8 = TP4056: Manufacturer: TOPPOWER(南京拓微); Manufacturer Part: TP4056-42-ESOP8; Contributor: Guest; Supplier: LCSC; Supplier Part: C16581; JLCPCB Part Class: Extended Part; spicePre: U; spiceSymbolName: TP4056

## Nets that join several sheets
3V3: RemoteMain (26 pins), RemoteSensors (16 pins), PowerManagement (5 pins)
GND: RemoteMain (27 pins), RemoteSensors (19 pins), PowerManagement (21 pins)
Accel_Int1: RemoteMain (U2.8), RemoteSensors (U4.11)
Accel_Int2: RemoteMain (U2.9), RemoteSensors (U4.9)
Accel_SCL_SCLK: RemoteMain (P5.1 TP1.1 U2.4), RemoteSensors (R7.1 U4.4 U7.B2)
Accel_SDA_MOSI: RemoteMain (P5.2 TP2.1 U2.5), RemoteSensors (R8.1 U4.6 U7.A2)
GPIO19/SMD: RemoteMain (U2.30), RemoteSensors (Q1.3 R4.2)
HS_Interrupt: RemoteMain (U2.29), RemoteSensors (U7.C2)
Mic_Output: RemoteMain (P4.1 TP5.1 U2.38), RemoteSensors (C20.2 R10.2 U5.4)
USB_D_N: RemoteMain (R3.2), PowerManagement (J1.2)
USB_D_P: RemoteMain (R5.2), PowerManagement (J1.3)

## Assembly variants
No through hole: not fitted P3